# Altium schematic sheet LEDPower.SchDoc
size A
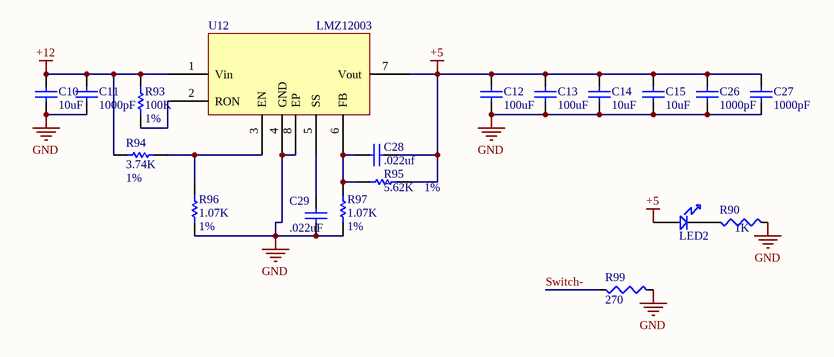
[diagram p0: LEDPower.SchDoc]

## Parts
C10  10uF  [0805 (2012) Capacitor]
C11  1000pF  [0805 (2012) Capacitor]
C12  100uF  [1210 (3225) Capacitor]
C13  100uF  [1210 (3225) Capacitor]
C14  10uF  [0805 (2012) Capacitor]
C15  10uF  [0805 (2012) Capacitor]
C26  1000pF  [0805 (2012) Capacitor]
C27  1000pF  [0805 (2012) Capacitor]
C28  .022uf  [0805 (2012) Capacitor]
C29  .022uF  [0805 (2012) Capacitor]
LED2  LED  [LED 0805]  (value not drawn)
R90  1K  [0805 (2012) Capacitor]
R93  Tolerance: 1%  [R 0805 (2012) RESISTOR]  (hidden comment: 100K)
R94  Tolerance: 1%  [R 0805 (2012) RESISTOR]  (hidden comment: 3.74K)
R95  Tolerance: 1%  [R 0805 (2012) RESISTOR]  (hidden comment: 5.62K)
R96  Tolerance: 1%  [R 0805 (2012) RESISTOR]  (hidden comment: 1.07K)
R97  Tolerance: 1%  [R 0805 (2012) RESISTOR]  (hidden comment: 1.07K)
R99  270  [0805 (2012) Capacitor]
U12  LMZ12003  [7-Lead PFM]

## Nets
+5: C12.2 C13.2 C14.1 C15.1 C26.1 C27.1 C28.1 LED2.2 R95.1 U12.7(Vout)
+12: C10.2 C11.2 R93.2 R94.2 U12.1(Vin)
GND: C10.1 C11.1 C12.1 C13.1 C14.2 C15.2 C26.2 C27.2 C29.1 R90.2 R96.1 R97.2 R99.2 U12.4(GND) U12.8(EP)
Switch-: R99.1
NetC28_2: C28.2 R95.2 R97.1 U12.6(FB)
NetC29_2: C29.2 U12.5(SS)
NetLED2_1: LED2.1 R90.1
NetR93_1: R93.1 U12.2(RON)
NetR94_1: R94.1 R96.2 U12.3(EN)

## Library data of the parts
C10 = Capacitor (non-polarized): Capacitor; Voltage Rating: 25 V; Value: 10uF
C11 = Capacitor (non-polarized): Capacitor; Voltage Rating: 25V; Value: 1000pF
C12-C15 C26-C29 = Capacitor (non-polarized): Capacitor
  C12 C13: Value: 100uF
  C14 C15: Value: 10uF
  C26 C27: Value: 1000pF
  C28: Value: .022uf
  C29: Value: .022uF
LED2 = LED: Standard LED
R90 R99 = Resistor: Value: 0Ohm
R93-R97 = RES 0805 1K 1%
  R93: Value: 100K
  R94: Value: 3.74K
  R95: Value: 5.62K
  R96 R97: Value: 1.07K